# Altium project AC_DC24V8A_LD7575SMD.PrjPcb
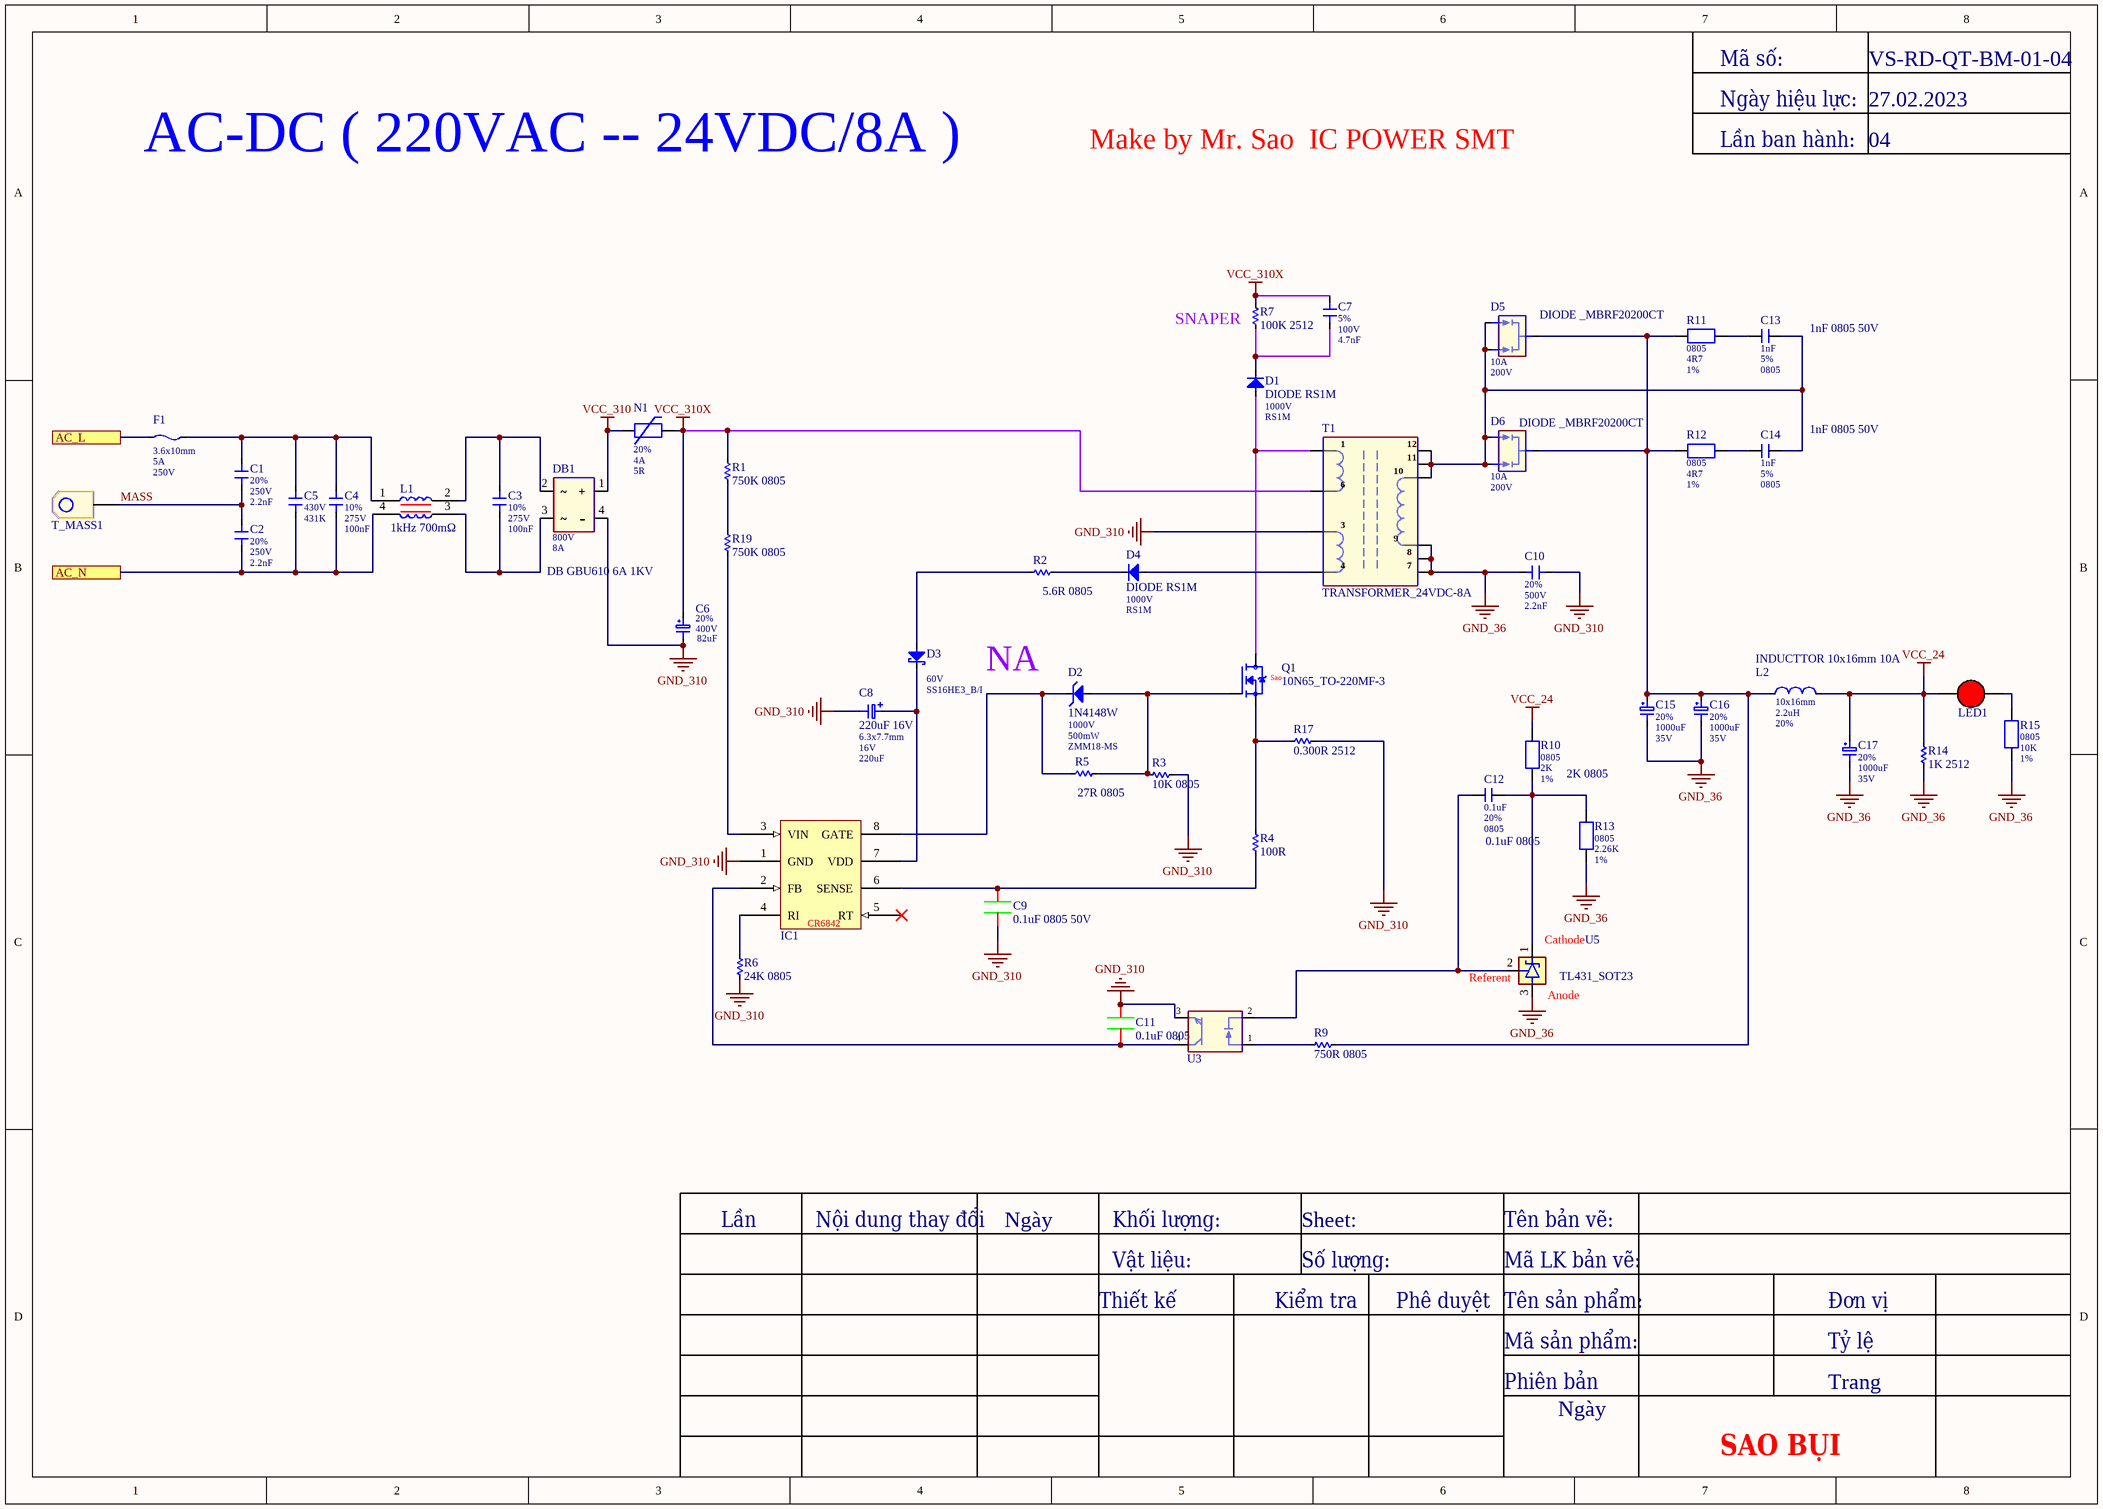
[diagram p0: 24V8A.SchDoc]
1 sheet, 51 parts. Net scope: flat (ports and power ports of the same name join across sheets).
Board file: AC_DC_24V8A.PcbDoc

## Sheet 24V8A.SchDoc
size A3; SheetNumber: 1; SheetTotal: 1

### Parts
C1  Tolerance: 20%  Voltage: 250V  Capacitance: 2.2nF  [CAP_CT707BY5V222M250VACB]  (hidden comment: 2.2nF 250V)
C2  Tolerance: 20%  Voltage: 250V  Capacitance: 2.2nF  [CAP_CT707BY5V222M250VACB]  (hidden comment: 2.2nF 250V)
C3  Tolerance: 10%  Voltage: 275V  Capacitance: 100nF  [CAP-FILM_X2-104K-275VAC]  (hidden comment: 100nF 275V P=15mm)
C4  Tolerance: 10%  Voltage: 275V  Capacitance: 100nF  [CAP-FILM_X2-104K-275VAC]  (hidden comment: 100nF 275V P=15mm)
C5  Voltage: 430V  Capacitance: 431K  [C_7D431K]  (hidden comment: 10D471)
C6  Tolerance: 20%  Voltage: 400V  Capacitance: 82uF  [CAP-ALUM_SHC450V100UF01EC3238]  (hidden comment: CAP-ALUM,TH;100uF,20%,18x36mm,450V)
C7  Tolerance: 5%  Voltage: 100V  Capacitance: 4.7nF  [CAP-MICA_CFA2A472JN0231]  (hidden comment: 4.7nF 100V)
C8  220uF 16V  Package: 6.3x7.7mm  Voltage: 16V  Capacitance: 220uF  [C_ALUM_6.3x7.7mm]
C9  0.1uF 0805 50V  [CN-SMD-0805]
C10  Tolerance: 20%  Voltage: 500V  Capacitance: 2.2nF  [C_DE1E3RA222MJ4BQ01F]  (hidden comment: 2.2nF 500V)
C11  0.1uF 0805  [CN-SMD-0805]
C12  0.1uF 0805  Capacitance: 0.1uF  Tolerance: 20%  Package: 0805  [C_0805_H0.5]
C13  1nF 0805 50V  Capacitance: 1nF  Tolerance: 5%  Package: 0805  [C_0805_H0.5]
C14  1nF 0805 50V  Capacitance: 1nF  Tolerance: 5%  Package: 0805  [C_0805_H0.5]
C15  Tolerance: 20%  Capacitance: 1000uF  Voltage: 35V  [CAP-ALUM_ 50V470uF CD288]  (hidden comment: 470uF 50V)
C16  Tolerance: 20%  Capacitance: 1000uF  Voltage: 35V  [CAP-ALUM_ 50V470uF CD288]  (hidden comment: 470uF 50V)
C17  Tolerance: 20%  Capacitance: 1000uF  Voltage: 35V  [CAP-ALUM_ 50V470uF CD288]  (hidden comment: 470uF 50V)
D1  DIODE RS1M  Voltage: 1000V  Manufacture Part Number 1: RS1M  [DO-214AC]
D2  1N4148W  Voltage: 1000V  Power: 500mW  Manufacture Part Number 1: ZMM18-MS  [SOD-80]
D3  Voltage: 60V  Manufacture Part Number 1: SS16HE3_B/I  [DIODE-SCHOTTKY_SS34B]  (hidden comment: DIODE_FR107 ( F7 ))
D4  DIODE RS1M  Voltage: 1000V  Manufacture Part Number 1: RS1M  [DO-214AC]
D5  DIODE _MBRF20200CT  Power: 10A  Voltage: 200V  [TO220H2]
D6  DIODE _MBRF20200CT  Power: 10A  Voltage: 200V  [TO220H2]
DB1  DB GBU610 6A 1KV  Voltage: 800V  Power: 8A  [DIODE-DRIDGE_KBL608]
F1  Package: 3.6x10mm  Power: 5A  Voltage: 250V  [FUSE_0674.500DRT4]  (hidden comment: FUSE 5A 250V)
IC1  CR6842  [SOP8]  (value not drawn)
L1  1kHz 700mΩ  [UU9.8-5mH]
L2  INDUCTTOR 10x16mm 10A  Package: 10x16mm  Inductance: 2.2uH  Tolerance: 20%  [IND_ AIUR-03-2R2M]
LED1  LED;2V,20mA,0805,RED,LSM0805412V  [LED-1206-Red]  (value not drawn)
N1  Tolerance: 20%  Power: 4A  Resistance: 5R  [THERMISTOR_SCN5D-11]  (hidden comment: THERMISTOR_SCN5D-11)
Q1  10N65_TO-220MF-3  [TO220H2]
R1  750K 0805  [RES-SMD-0805]
R2  5.6R 0805  [RES-SMD-0805]
R3  10K 0805  [RES-SMD-0805]
R4  100R  [RES-SMD-0805]
R5  27R 0805  [RES-SMD-0805]
R6  24K 0805  [RES-SMD-0805]
R7  100K 2512  [RES-SMD-2512]
R9  750R 0805  [RES-SMD-0805]
R10  2K 0805  Package: 0805  Resistance: 2K  Tolerance: 1%  [R_0805_H0.5]
R11  Package: 0805  Resistance: 4R7  Tolerance: 1%  [R_0805_H0.5]  (hidden comment: 4.7R 0805)
R12  Package: 0805  Resistance: 4R7  Tolerance: 1%  [R_0805_H0.5]  (hidden comment: 4.7R 0805)
R13  Package: 0805  Resistance: 2.26K  Tolerance: 1%  [R_0805_H0.5]  (hidden comment: 2.26K 0805)
R14  1K 2512  [RES-SMD-2512]
R15  Package: 0805  Resistance: 10K  Tolerance: 1%  [RES_SMD_0805]  (hidden comment: 10K 0805)
R17  0.300R 2512  [RES-SMD-2512]
R19  750K 0805  [RES-SMD-0805]
T1  TRANSFORMER_24VDC-8A  [TRANSFORMER_24V-8A]
T_MASS1  TERMINAL_63824-5  [TERMINAL_63824-5]  (value not drawn)
U3  PC817B  [PC817_DIP]  (value not drawn)
U5  TL431_SOT23  [TL431_SOT23]

### Ports
AC_L, AC_N

### Nets
GND_36: C10.2 C15.1 C16.1 C17.1 R13.2 R14.2 R15.1 T1.7 T1.8 T1.9 U5.3(ANODE)
GND_310: C6.1 C8.N C9.1 C10.1 C11.2 DB1.4(-) IC1.1(GND) R3.1 R6.2 R17.1 T1.3 U3.3
VCC_24: C17.2 L2.2 LED1.1(A) R10.1 R14.1
VCC_310: DB1.1(+) N1.1
VCC_310X: C6.2 C7.1 N1.2 R1.1 R7.2 T1.6
MASS: C1.2 C2.1 T_MASS1.1
NetC1_1: C1.1 C4.2 C5.1 F1.2 L1.1
NetC2_2: C2.2 C4.1 C5.2 L1.4 ; port AC_N
NetC3_1: C3.1 DB1.3 L1.3
NetC3_2: C3.2 DB1.2 L1.2
NetC7_2: C7.2 D1.K R7.1
NetC8_P: C8.P D3.K IC1.7(VDD)
NetC9_2: C9.2 IC1.6(SENSE) R4.2
NetC11_1: C11.1 IC1.2(FB) U3.4
NetC12_1: C12.1 R10.2 R13.1 U5.1(CATHODE)
NetC12_2: C12.2 U3.2 U5.2(REF)
NetC13_1: C13.1 C14.1 D5.1(A) D5.3(A) D6.1(A) D6.3(A) T1.10 T1.11 T1.12
NetC13_2: C13.2 R11.2
NetC14_2: C14.2 R12.2
NetC15_2: C15.2 C16.2 D5.2(K) D6.2(K) L2.1 R9.1 R11.1 R12.1
NetD1_A: D1.A Q1.2(D) T1.1
NetD2_A: D2.A Q1.1(G) R3.2 R5.1
NetD2_K: D2.K IC1.8(GATE) R5.2
NetD3_A: D3.A R2.2
NetD4_A: D4.A T1.4
NetD4_K: D4.K R2.1
NetF1_1: F1.1 ; port AC_L
NetIC1_3: IC1.3(VIN) R19.2
NetIC1_4: IC1.4(RI) R6.1
NetLED1_2: LED1.2(K) R15.2
NetQ1_3: Q1.3(S) R4.1 R17.2
NetR1_2: R1.2 R19.1
NetR9_2: R9.2 U3.1

Not connected (* = marked no-connect by the designer): IC1 5(RT)*

### Notes on the sheet
- AC-DC ( 220VAC -- 24VDC/8A )
- Make by Mr. Sao  IC POWER SMT
- (near R7) SNAPER
- NA
- Mã số:
- Ngày hiệu lực:
- 27.02.2023
- VS-RD-QT-BM-01-04
- Lần ban hành:
- 04
- Lần
- Nội dung thay đổi
- Ngày
- Khối lượng:
- Sheet:
- Tên bản vẽ:
- Thiết kế
- Vật liệu:
- Kiểm tra
- Số lượng:
- Phê duyệt
- Mã LK bản vẽ:
- Tên sản phẩm:
- Đơn vị
- Mã sản phẩm:
- Phiên bản
- Tỷ lệ
- Trang
- SAO BỤI
- (in symbol FCD9N60NTM) Sao
- (in symbol TL431) Cathode; Referent; Anode

### Library data of the parts
C1 C2 = CAP-VAR;TH,2.2nF,20%,P=5mm,250V: CAP-VAR;TH,2.2nF,20%,P=5mm,250V / - Partnumber: CT707BY5V222M250VACB / - MPN: YU YUE / - https://www.lcsc.com/product-detail/Suppression-Capacitors_YU-YUE-CT707BY5V222M250VACB_C2832672.html; Manufacture 1: YU YUE; Name: CAP-VAR_TH_2.2nF_20%_P=5mm_250V; Link: https://www.lcsc.com/product-detail/Suppression-Capacitors_YU-YUE-CT707BY5V222M250VACB_C2832672.html; Manufacture Part Number 1: CT707BY5V222M250VACB; Package: P=5mm
C3 C4 = CAP-FILM;TH,100nF,10%,P=15mm,275V: CAP-FILM;TH,100nF,10%,P=15mm,275V / - Partnumber: X2-104K-275VAC / - MPN: NDF / - https://www.lcsc.com/product-detail/Suppression-Capacitors_NDF-X2-104K-275VAC_C914484.html; Name: CAP-FILM_TH_100nF_10%_P=15mm_275V; Link: https://www.lcsc.com/product-detail/Suppression-Capacitors_NDF-X2-104K-275VAC_C914484.html; Manufacture 1: NDF; Manufacture Part Number 1: X2-104K-275VAC; Package: P=15mm
C5 = CAP-VAR;TH,07D431K,P=5mm,430V: CAP-VAR;TH,07D431K,P=5mm,430V / - Partnumber: 10D471K / - MPN: RUILON(Shenzhen Ruilongyuan Elec) / - https://www.lcsc.com/product-detail/Varistors_RUILON-Shenzhen-Ruilongyuan-Elec-10D471K_C8760.html; Manufacture 1: SURGING; Manufacture Part Number 1: 7D431K; Name: CAP-MICA_TH_07D431K_P=5mm_500V; Link: https://www.lcsc.com/product-detail/Varistors_SURGING-7D431K_C2839551.html; Package: P=5mm
C6 = CAP-ALUM,TH;100uF,20%,18x36mm,450V: CAP-ALUM,TH;100uF,20%,18x36mm,450V / - Partnumber: / SHC450V100UF01EC3238 / - KNSCHA / - https://www.lcsc.com/product-detail/Aluminum-Electrolytic-Capacitors-Leaded_KNSCHA-SHC450V100UF01EC3238_C5263886.html; Name: CAP-ALUM_TH_100uF_20%_18x36mm_450V; Manufacture 1: KNSCHA; Link: https://www.lcsc.com/product-detail/Aluminum-Electrolytic-Capacitors-Leaded_KNSCHA-SHC450V100UF01EC3238_C5263886.html; Manufacture Part Number 1: SHC450V100UF01EC3238
C7 = CAP-MICA;TH,4.7nF,5%,P=4mm,100V: CAP-MICA;TH,4.7nF,5%,P=8mm,100V / - Partnumber: CFA2A472JN0231 / - MPN: Dersonic / - https://www.lcsc.com/product-detail/Film-Capacitors_Dersonic-CFA2A472JN0231_C4945000.html; Name: CAP-MICA_TH_4.7nF_5%_P=4mm_100V; Link: https://www.lcsc.com/product-detail/Film-Capacitors_Dersonic-CFA2A472JN0231_C4945000.html; Manufacture 1: ersonic; Manufacture Part Number 1: CFA2A472JN0231; Package: P=4mm
C8 = CMP-002-000004-3: CAP-ALUM; SMD, 220uF,20%, 6.3x7.7mm,16V,2000 Hrs @ 105°C / -Partnumber:OVZ221M1CTR-0608ACS / - MPN: Lelon; Manufacture Part Number 1: UWT1A221MCL1GS; Manufacture 1: Nichicon; Special Info: <Special Info>; Mouting type: SMD; Temperature: -55°C ~ 105°C; Tolerance: 20%; MSL: 1; Standard: <Standard>; Link: <Link>
C9 C11 = CAP_SMD: CAP_CER_SMD, 0.1uF, 20%, 50V, 0805, CT41G-0805-2X1-50V-0.1μF-M(N), TORCH / - Partnumber: 08055C104KAZ2A / - MPN: Kyocera AVX
C10 = CAP-VAR;TH,2.2nF,20%,P=9mm,500V: CAP-VAR;TH,2.2nF,20%,P=10mm,500V / - Partnumber: CD45-E2GA222M-NKA / - MPN: TDK / - https://www.mouser.vn/ProductDetail/TDK/CD45-E2GA222M-NKA?qs=zFwFjAF3uainArWjG3%252BKUA%3D%3D; Manufacture 1: Murata Electronics; Manufacture Part Number 1: DE1E3RA222MJ4BQ01F; Name: CAP-VAR_TH_2.2nF_20%_P=9mm_500V; Link: https://www.lcsc.com/product-detail/Suppression-Capacitors_Murata-Electronics-DE1E3RA222MJ4BQ01F_C237526.html; Package: P=9mm
C12 = CAP-CER_SMD_100nF_20%_0805_50V_X7R: CAP_CER_SMD, 0.1uF, 20%, 50V, 0805, CT41G-0805-2X1-50V-0.1μF-M(N), TORCH / - Partnumber: 08055C104KAZ2A / - MPN: Kyocera AVX; Manufacture Part Number 1: 08055C104M4T4A; Mouting type: SMD; Name: CAP_CER_SMD_100nF_20%_0805_50V_X7R; Link: https://www.mouser.vn/ProductDetail/KYOCERA-AVX/08055C104M4T4A?qs=xMTsDkQFXIy%252BVvJLAuiCrA%3D%3D; Manufacture 1: KYOCERA AVX; MSL: *; Special Infor: *; Standard: *; Temperature: - 55℃ ~ +125℃; Voltage: 50V
C13 C14 = CAP-CER_SMD_1nF_5%_0805_50V_X7R: CAP-CER_SMD_1nF_5%_0805_50V_X7R / - Partnumber: C0805COG102J500NT / - MPN: SANYEAR / - https://www.lcsc.com/product-detail/Multilayer-Ceramic-Capacitors-MLCC-SMD-SMT_SANYEAR-C0805COG102J500NT_C2835510.html; Manufacture 1: KYOCERA AVX; Manufacture Part Number 1: 08055C102JAT4A; Mouting type: SMD; Name: CAP_CER_SMD_1nF_5%_0805_50V_X7R; Link: https://www.mouser.vn/ProductDetail/KYOCERA-AVX/08055C102JAT4A?qs=ykEKLGTiBcyfRhiaKOR2RA%3D%3D; MSL: *; Special Infor: *; Standard: *; Temperature: - 55℃ ~ +125℃; Voltage: 50V
C15-C17 = CAP-ALUM,TH;470uF,20%,10x20mm,50V: CAP-ALUM,TH;470uF,20%,10x20mm,50V / - Partnumber:  50V470uF CD288 / - MPN: HRK / - https://www.lcsc.com/product-detail/Aluminum-Electrolytic-Capacitors-Leaded_HRK-50V470uF-CD288_C2960279.html; Name: CAP-ALUM_TH_470uF_20%_10x20mm_50V; Manufacture Part Number 1: 50V470uF CD288; Manufacture 1: HRK; Link: https://www.lcsc.com/product-detail/Aluminum-Electrolytic-Capacitors-Leaded_HRK-50V470uF-CD288_C2960279.html; Temperature: -40℃~+105℃
D1 D4 = CMP-00191-2: DIODE-RECTIFIER;1000V,1A, / - Partnumber: RS1M / - MPN: onsemi / Fairchild / - https://www.mouser.vn/ProductDetail/onsemi-Fairchild/RS1M?qs=e%2FRqmsgwm9icSRWI%2F467wA%3D%3D; Manufacture 1: YFW; Mouting type: TH; Special Info: <Special Info>; Temperature: -55°C ~ 125°C; Current: 1A; Standard: <Auto/Gen/...>; MSL: 1
D2 = CMP-016-0014-2: Diode_SMD, 1N4148W, T4   SOD123 / - 100V 400mW 1.25V@150mA 8ns 150mA SOD-123 Switching Diode ROHS; Manufacture 1: MSKSEMI; Special Info: <Special Info>; Mouting type: SMD; Temperature: -55°C ~ 175°C; MSL: 1; Package: SOD-80; Standard: <Standard>
D3 = CMP-016-0006-5: DIODE_SMD, SOD123F / - Partnumber: FR107 / - MPN: YONGYUTAI / - https://www.lcsc.com/product-detail/Diodes-Fast-Recovery-Rectifiers_YONGYUTAI-FR107_C2892668.html; Manufacture 1: Vishay; Special Info: <Special Info>; Current: 1A; Mouting type: SMD; MSL: 1; Standard: <Standard>; Temperature: -65°C ~ 150°C
D5 = DIODE-SCHOTTKY;200V,10A,TO-220,MBRF20200CT: DIODE-SCHOTTKY;200V,10A,TO-220,MBRF20200CT / - Partnumber: MBRF20200CT / - MPN: HUAKE / - https://www.lcsc.com/product-detail/Schottky-Barrier-Diodes-SBD_HUAKE-MBRF20200CT_C570157.html / - Heat shink: https://detail.1688.com/offer/712464083101.html?share_token=hq0vxk5x%2FN5Tv73PkK2Og6bf5KY8XkUtpw2Ne6gJ7w6yARb+OrftPg%3D%3D&__share_id=b45a966c-b633-4f91-bb34-55e368e43958&rpg-cnt=share.offerDetail&offerId=712464083101&__zhi_token=RERNaFb30oXak&spm=a262eq.8992535%2F20230925.5103953.0&__NEWPC__=false; Name: DIODE-SCHOTTKY_MBRF20200CT; Manufacture Part Number 1: MBRF20200CT; Manufacture 1: HUAKE; Link: https://www.lcsc.com/product-detail/Schottky-Barrier-Diodes-SBD_HUAKE-MBRF20200CT_C570157.html
D6 = DIODE-SCHOTTKY;200V,10A,TO-220,MBRF20200CT: DIODE-SCHOTTKY;200V,10A,TO-220,MBRF20200CT / - Partnumber: MBRF20200CT / - MPN: HUAKE / - https://www.lcsc.com/product-detail/Schottky-Barrier-Diodes-SBD_HUAKE-MBRF20200CT_C570157.html; Name: DIODE-SCHOTTKY_MBRF20200CT; Manufacture Part Number 1: MBRF20200CT; Manufacture 1: HUAKE; Link: https://www.lcsc.com/product-detail/Schottky-Barrier-Diodes-SBD_HUAKE-MBRF20200CT_C570157.html
DB1 = DIODE-BRIDGE_KBL608: DIODE-BRIDGE_GBU610 / - Partnumber: GBU610 / - MPN: JUXING / - https://www.lcsc.com/product-detail/Bridge-Rectifiers_JUXING-GBU610_C3011064.html; Manufacture Part Number 1: KBL608; Manufacture 1: YFW; Name: DIODE-BRIDGE_KBL608; Link: https://www.lcsc.com/product-detail/Bridge-Rectifiers_YFW-KBL608_C3039976.html
F1 = FUSE;CERAMIC,5A,250V,3.6x10mm,0674.500DRT4: FUSE;CERAMIC,5A,250V,3.6x10mm, / - Partnumber: 0674.500DRT4 / - MPN:Littelfuse / - https://www.mouser.vn/ProductDetail/Littelfuse/0674.500DRT4?qs=WtG364jHAdwcoqDCh26Gkw%3D%3D; Name: FUSE_0674.500DRT4; Manufacture Part Number 1: 0674.500DRT4; Manufacture 1: Littelfuse; Link: https://www.mouser.vn/ProductDetail/Littelfuse/0674.500DRT4?qs=WtG364jHAdwcoqDCh26Gkw%3D%3D; Temperature: -55℃~+125℃
IC1 = IC_POWER; AC/DC; SOP8; CR6842S: IC_POWER; AC/DC; SOP8; CR6842; Manufacturer: Chip-Rail; Manufacturer Part Number: CR6842; Link: https://www.lcsc.com/product-detail/AC-DC-Controllers-Regulators_Chip-Rail-CR6842_C433386.html; Value: CR6842; ComponentLink1Description: Link 1; ComponentLink1URL: https://www.lcsc.com/product-detail/AC-DC-Controllers-Regulators_Chip-Rail-CR6842_C433386.html
L1 = MODE_CHOKE_DIP, 5mH , 4PIN, UU9.8-5mH: MODE_CHOKE_DIP, 5mH , 4PIN, UU9.8-5mH, 1kHz 700mΩ; Manufacturer: FH (Guangdong Fenghua Advanced Tech); ComponentLink1Description: Link; ComponentLink1URL: https://www.lcsc.com/product-detail/Common-Mode-Filters_FH-Guangdong-Fenghua-Advanced-Tech-UU9-8-5mH_C116373.html; Manufacturer Part Number: UU9.8-5mH; Package: Plugin; Value: 1kHz 700mΩ
L2 = IND;2.2uH,20%,9x12mm,3.2A,21mR: IND;2.2uH,20%,10x16mm,10A / - https://www.elecify.com/products/2-2uh-ferrite-rod-core-inductor-6-x-15mm-10-5-turns; Manufacture Part Number 1: AIUR-03-2R2M; Manufacture 1: Abracon LLC; Name: IND_ AIUR-03-2R2M; Link: https://www.lcsc.com/product-detail/Power-Inductors_Abracon-LLC-AIUR-03-2R2M_C1331303.html
LED1 = LED;2V,20mA,0805,RED,LSM0805412V: LED;2V,20mA,0805,RED,LSM0805412V / - Partnumber: NCD0805R1 / - MPN: Foshan NationStar Optoelectronics; Manufacture 1: VCC; Name: LED_LSM0805412V; Color: Red; Temperature: *; MSL: *; Voltage: 2V; Current: 20mA; Manufacture Part Number 1: LSM0805412V; Special Info: *; Link: https://www.mouser.com/ProductDetail/VCC/LSM0805412V?qs=T3oQrply3y%2F3hzU4lskNyg%3D%3D
N1 = THERMISTOR_SCN5D-11: THERMISTOR_SCN5D-11 / - Partnumber:  VDR Varistor / - MPN:  VDR Varistor; Manufacture 1: SOCAY Elec; Name: THERMISTOR_SCN5D-11; Manufacture Part Number 1: SCN5D-11; Link: https://www.lcsc.com/product-detail/NTC-Thermistors_SOCAY-Elec-SCN5D-11_C305626.html
Q1 = FCD9N60NTM: MOSFET_DIP, Power; N-Ch; VDSS 650V; RDS(ON) 44Milliohms; ID 20A; TO-220MF-3 / - Partnumber: SWM20N65D / - MPN: Samwin / - Heat shink: https://detail.1688.com/offer/625809293739.html?spm=a261y.7663282.1998411376.3.72d13138qz38n8&scm=1007.19151.204703.00&ODitemId=712464083101&itemId=625809293739&pvid=2963f6d0-b02b-4fa9-83f2-a229bd9d8652&extStr=625809293739..712464083101..964445090..1.0..1.0..39.5122036509141..1.0..cat3..1032340..no..odTab..213250_17282_17474_17538_18050_17410_17026_16962_16514_16834_16770_18754_18114_2191362..2963f6d0-b02b-4fa9-83f2-a229bd9d8652..0.0..1007.19151.204703.0..2147483647..1.0..-10......0..-1......&__NEWPC__=false / - https://linhkien.cxt.vn/9730-fcd9n60ntm-9n60-n-mosfet-9a-600v-to-252.html / - Heat Shink: https://detail.1688.com/pic/44688954741.html?spm=a261y.7663282.autotrace-offerDetailContext1.2.7e4c27c4BVBCnO&__NEWPC__=false; MF: Infineon Technologies; MP: IRF540NSTRLPBF; Check_prices: https://www.snapeda.com/parts/IRF540NSTRLPBF/Infineon+Technologies/view-part/?ref=eda; Availability: In Stock; Value: *; Price: None; Package: D2PAK Infineon / IR; Purchase-URL: https://pricing.snapeda.com/search/part/IRF540NSTRLPBF/?ref=eda; SnapEDA_Link: https://www.snapeda.com/parts/IRF540NSTRLPBF/Infineon+Technologies/view-part/?ref=snap
R1 R6 R19 = Res-SMD: RES_SMD, 20K , 1%, 0805 / - Partnumber: SCR0805F20K / - MPN: VO / - https://www.lcsc.com/product-detail/Chip-Resistor-Surface-Mount_VO-SCR0805F20K_C5140118.html; Manufacturer: Generic Components; Class: Passive; Published: 08/06/2000; Publisher: Altium Hobart Technology Centre
R2 = Res-SMD: RES_SMD, 5.6R , 1%, 0805 / - Partnumber: CR0805-F/-5R60ELF / - MPN: Bourns / - https://www.mouser.vn/ProductDetail/Bourns/CR0805-F-5R60ELF?qs=sGAEpiMZZMtlubZbdhIBIGzYZ6FHPeqACAgosWFvIMU%3D; Manufacturer: Generic Components; Class: Passive; Published: 08/06/2000; Publisher: Altium Hobart Technology Centre
R3 = Res-SMD: RES_SMD, 10K , 1%, 0805 / - Partnumber: RC0805FR-0710KL / - MPN: YAGEO / - https://www.mouser.vn/ProductDetail/YAGEO/RC0805FR-0710KL?qs=7bY8808IzHq6vrU3BeiiYw%3D%3D; Manufacturer: Generic Components; Class: Passive; Published: 08/06/2000; Publisher: Altium Hobart Technology Centre
R4 = Res-SMD: RES_SMD, 1K , 1%, 0805 / - Partnumber: CHP0805AFX-1001ELF / - MPN: Bourns; Manufacturer: Generic Components; Class: Passive; Published: 08/06/2000; Publisher: Altium Hobart Technology Centre
R5 = Res-SMD: RES_SMD, 27R , 1%, 0805 / - Partnumber: CR0805F827R0G / - MPN: LIZ Elec / - https://www.lcsc.com/product-detail/Chip-Resistor-Surface-Mount_LIZ-Elec-CR0805F827R0G_C101623.html; Manufacturer: Generic Components; Class: Passive; Published: 08/06/2000; Publisher: Altium Hobart Technology Centre
R7 = Res-SMD: RES_SMD, 100K, 1%, 2512 / - Partnumber: SCR2512J100K / - MPN: VO / - https://www.lcsc.com/product-detail/Chip-Resistor-Surface-Mount_VO-SCR2512J100K_C3018375.html; Manufacturer: Generic Components; Class: Passive; Published: 08/06/2000; Publisher: Altium Hobart Technology Centre
R9 = Res-SMD: RES_SMD, 750R , 1%, 0805 / - Partnumber: RC0805FR-7W750RL / - MPN: YAGEO / - https://www.mouser.vn/ProductDetail/YAGEO/RC0805FR-7W750RL?qs=AQlKX63v8RsS4mCFcDrRUQ%3D%3D; Manufacturer: Generic Components; Class: Passive; Published: 08/06/2000; Publisher: Altium Hobart Technology Centre
R10 = RES-SMD;2K,1%,0805,1/8W: RES_SMD, 2K , 1%, 0805 / - Partnumber: CR0805-FX-2001ELF / - MPN: Bourns / - https://www.mouser.vn/ProductDetail/Bourns/CR0805-FX-2001ELF?qs=Woncl1%2FcWdj4pm%252BkHXByog%3D%3D; Manufacture 1: YAGEO; Manufacture Part Number 1: RC0805FR-072KL; Name: RES_SMD_2K_1%_0805_1/8W; Mouting type: SMD; Power: 1/8W; Temperature: -55℃ ~ 155℃; Standard: *; Special Infor: *; MSL: *; Link: https://www.mouser.vn/ProductDetail/YAGEO/RC0805FR-072KL?qs=QrWOOBGzeCYk%2Fx0gjMNmqg%3D%3D
R11 R12 = RES-SMD;5R6,1%,0805,1/8W: RES_SMD, 4.7R , 1%, 0805 / - Partnumber: HoCR2512-2W-4.7R-1% / - MPN: Milliohm / -https://www.lcsc.com/product-detail/Chip-Resistor-Surface-Mount_Milliohm-HoCR2512-2W-4-7R-1_C5123630.html; Manufacture 1: Bourns; Manufacture Part Number 1: CR0805-F/-5R60ELF; Name: RES_SMD_5R6_1%_0805_1/8W; Mouting type: SMD; Power: 1/8W; Temperature: -55℃ ~ 155℃; Standard: *; Special Infor: *; MSL: *; https://www.mouser.vn/ProductDetail/Bourns/CR0805-F-5R60ELF?qs=W%2FMpXkg%252BdQ5ob6XqqtyBCg%3D%3D: Link
R13 = RES-SMD;1.5K,1%,0805,1/8W: RES_SMD, 1.5K , 1%, 0805 / - Partnumber: CRCW08051K50FKEA / - MPN: Vishay / Dale / - https://www.mouser.vn/ProductDetail/Vishay-Dale/CRCW08051K50FKEA?qs=sGAEpiMZZMukHu%252BjC5l7YTVXpHrBH8ar4bCI%2F%2FRA9TE%3D; Manufacture 1: YAGEO; Manufacture Part Number 1: RP0805BRD071K5L; Name: RES_SMD_1.5K_1%_0805_1/8W; Mouting type: SMD; Power: 1/8W; Temperature: -55℃ ~ 155℃; Standard: *; Special Infor: *; MSL: *; Link: https://www.mouser.vn/ProductDetail/YAGEO/RP0805BRD071K5L?qs=Y0Uzf4wQF3nJb82GeNwUaQ%3D%3D
R14 = Res-SMD: RES_SMD, 2.2K, 1%, 2512 / - Partnumber: SCR2512J2K2 / - MPN: VO / - https://www.lcsc.com/product-detail/Chip-Resistor-Surface-Mount_VO-SCR2512J2K2_C3018402.html; Manufacturer: Generic Components; Class: Passive; Published: 08/06/2000; Publisher: Altium Hobart Technology Centre
R15 = RES-SMD;10K,1%,0805,1/8W: RES_SMD, 10K , 1%, 0805 / - Partnumber: RC0805FR-0710KL / - MPN: YAGEO / - https://www.mouser.vn/ProductDetail/YAGEO/RC0805FR-0710KL?qs=7bY8808IzHq6vrU3BeiiYw%3D%3D; Name: RES_SMD_10K_1%_0805_1/8W; Mouting type: SMD; Power: 1/8W; Temperature: -55℃ ~ 155℃; Standard: *; Special Infor: *; MSL: *; Manufacture 1: YAGEO; Manufacture Part Number 1: RC0805FR-0710KL; ComponentLink1Description: Link; ComponentLink1URL: https://www.mouser.vn/ProductDetail/YAGEO/RC0805FR-0710KL?qs=7bY8808IzHq6vrU3BeiiYw%3D%3D
R17 = Res-SMD: RES_SMD, 0.39R, 1%, 2512 / - Partnumber: CS121WF390LT4E / - MPN: Royalohm / - https://www.mouser.vn/ProductDetail/Royalohm/CS121WF390LT4E?qs=Wj%2FVkw3K%252BMBosnUGFuHAzg%3D%3D; Manufacturer: Generic Components; Class: Passive; Published: 08/06/2000; Publisher: Altium Hobart Technology Centre
T1 = TRANSFORMER_24VDC-8A: TRANSFORMER_24VDC-8A, Mẫu biến áp dùng cho 24VDC-8A; Name: TRANSFORMER_EE32; Parameter 1: *
T_MASS1 = TERMINAL_63824-5: TERMINAL_63824-5 / - Partnumber: 63824-5 / - MPN: TE Connectivity; Name: TERMINAL_63824-5; Manufacture Part Number 1: 63824-5; Manufacture 1: TE Connectivity; Link: https://www.lcsc.com/product-detail/span-style-background-color-ff0-PCB-span-Welding-span-style-background-color-ff0-Terminal-span_TE-Connectivity-63824-5_C575056.html
U3 = OPTO-TH;PC817B: OPTO-TH;PC817B / - Partnumber: PC817X3NSZ1B / - MPN: Sharp Microelectronics / - https://www.mouser.vn/ProductDetail/Sharp-Microelectronics/PC817X3NSZ1B?qs=rrS6PyfT74duY52G%2FwhxFg%3D%3D; Manufacture 1: Slkor(SLKORMICRO Elec.); Name: OPTO-TH_PC817B; Package: DIP-4; Manufacture Part Number 1: PC817B; Link: https://www.lcsc.com/product-detail/Optocouplers-Phototransistor-Output_Slkor-SLKORMICRO-Elec-PC817B_C5186574.html
U5 = TL431: - Partnumber: TL431LIBEDBZRQ1 / - MPN: Texas Instruments